# EAGLE design ThrottleControl (EAGLE 5.07)
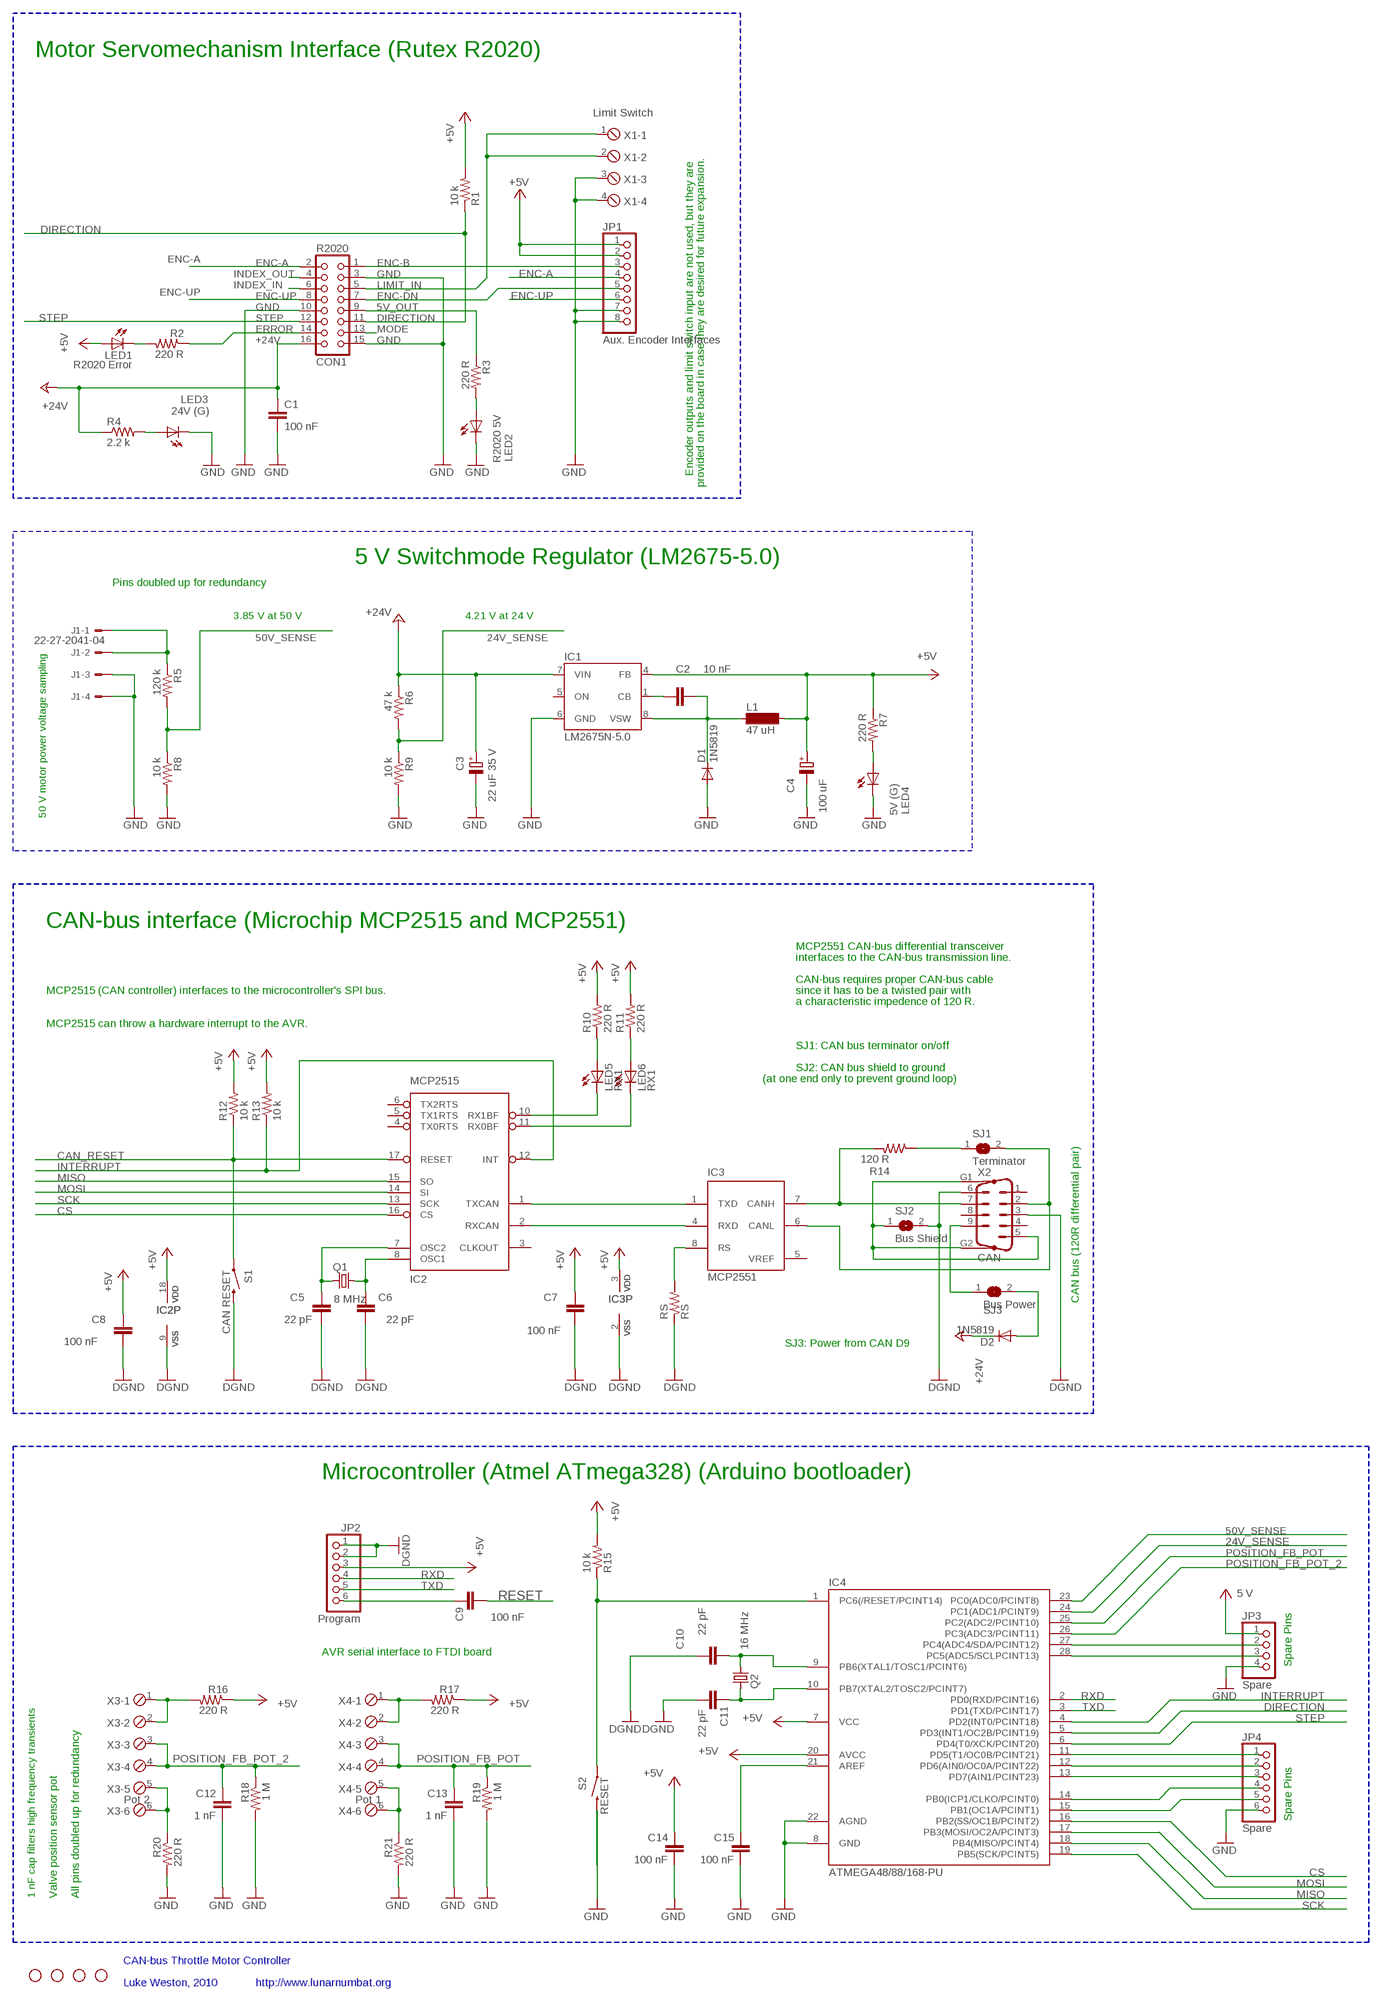
[diagram p0: schematic, sheet 1]

## Parts
C1  100 nF  C-EUC0805K  [C0805K]
C2  10 nF  C-EUC0805  [C0805]
C3  22 uF 35 V  CPOL-EUSMCD  [SMC_D]
C4  100 uF  CPOL-EUSMCD  [SMC_D]
C5  22 pF  C-EUC0805  [C0805]
C6  22 pF  C-EUC0805  [C0805]
C7  100 nF  C-EUC0805  [C0805]
C8  100 nF  C-EUC0805  [C0805]
C9  100 nF  C-EUC0805K  [C0805K]
C10  22 pF  C-EUC0805  [C0805]
C11  22 pF  C-EUC0805  [C0805]
C12  1 nF  C-EUC0805K  [C0805K]
C13  1 nF  C-EUC0805K  [C0805K]
C14  100 nF  C-EUC0805K  [C0805K]
C15  100 nF  C-EUC0805K  [C0805K]
CON1  R2020  CON16  [CON16]
D1  1N5819  DIODE-SOD123  [SOD123]
D2  1N5819  DIODE-SOD123  [SOD123]
IC1  LM2675N-5.0  LM2675M  [SO08]
IC2  MCP2515  MCP2510SO  [SO-18W]
IC3  MCP2551  MCP2551SN  [SO-08]
IC4  ATMEGA48/88/168-PU  [DIL28-3]
J1  22-27-2041-04  [6410-04]
JP1  Aux. Encoder Interfaces  PINHD-1X8  [1X08]
JP2  Program  PINHD-1X6  [1X06]
JP3  Spare  PINHD-1X4  [1X04]
JP4  Spare  PINHD-1X6  [1X06]
JP5  STAND-OFF  [STAND-OFF]
JP6  STAND-OFF  [STAND-OFF]
JP7  STAND-OFF  [STAND-OFF]
JP8  STAND-OFF  [STAND-OFF]
L1  47 uH  MS50  [MS50]
LED1  R2020 Error  LEDCHIP-LED0805  [CHIP-LED0805]
LED2  R2020 5V  LEDCHIP-LED0805  [CHIP-LED0805]
LED3  24V (G)  LEDCHIP-LED0805  [CHIP-LED0805]
LED4  5V (G)  LEDCHIP-LED0805  [CHIP-LED0805]
LED5  RX1  LEDCHIP-LED0805  [CHIP-LED0805]
LED6  RX1  LEDCHIP-LED0805  [CHIP-LED0805]
Q1  8 MHz  CRYSTALHC49UP  [HC49UP]
Q2  16 MHz  CRYSTALHC49UP  [HC49UP]
R1  10 k  R-US_M0805  [M0805]
R2  220 R  R-US_M0805  [M0805]
R3  220 R  R-US_M0805  [M0805]
R4  2.2 k  R-US_M0805  [M0805]
R5  120 k  R-US_M0805  [M0805]
R6  47 k  R-US_M0805  [M0805]
R7  220 R  R-US_M0805  [M0805]
R8  10 k  R-US_M0805  [M0805]
R9  10 k  R-US_M0805  [M0805]
R10  220 R  R-US_M0805  [M0805]
R11  220 R  R-US_M0805  [M0805]
R12  10 k  R-US_M0805  [M0805]
R13  10 k  R-US_M0805  [M0805]
R14  120 R  R-US_M0805  [M0805]
R15  10 k  R-US_M0805  [M0805]
R16  220 R  R-US_M0805  [M0805]
R17  220 R  R-US_M0805  [M0805]
R18  1 M  R-US_M0805  [M0805]
R19  1 M  R-US_M0805  [M0805]
R20  220 R  R-US_M0805  [M0805]
R21  220 R  R-US_M0805  [M0805]
RS  RS  R-US_M0805  [M0805]
S1  CAN RESET  SWITCH-MOMENTARY-2SMD  [TACTILE_SWITCH_SMD]
S2  RESET  SWITCH-MOMENTARY-2SMD  [TACTILE_SWITCH_SMD]
SJ1  Terminator  SJ  [SJ]
SJ2  Bus Shield  SJ  [SJ]
SJ3  Bus Power  SJ  [SJ]
X1  Limit Switch  MPT4  [4POL254]
X2  CAN  M09HP  [M09HP]
X3  Pot 2  MPT6  [6POL254]
X4  Pot 1  MPT6  [6POL254]

## Nets
5V_OUT: CON1.9 R3.1
24V_SENSE: IC4.24(PC1(ADC1/PCINT9)) R6.2 R9.1
50V_SENSE: IC4.23(PC0(ADC0/PCINT8)) R5.2 R8.1
+5V: C4.+ C7.2 C8.2 C14.1 IC1.4(FB) IC2.18(VDD) IC3.3(VDD) IC4.7(VCC) IC4.20(AVCC) JP1.1 JP1.2 JP2.3 JP3.1 L1.2 LED1.A R1.2 R7.1 R10.2 R11.2 R12.2 R13.2 R15.2 R16.1 R17.1 ; supply symbol labelled 5 V
+24V: C1.1 C3.+ CON1.16 D2.C IC1.7(VIN) R4.1 R6.1
CAN_RESET: IC2.17(RESET) R12.1 S1.1
CS: IC2.16(CS) IC4.16(PB2(SS/OC1B/PCINT2))
DIRECTION: CON1.11 IC4.5(PD3(INT1/OC2B/PCINT19)) R1.1
ENC-A: CON1.2 JP1.4
ENC-B: CON1.1 JP1.3
ENC-DN: CON1.7 JP1.5
ENC-UP: CON1.8 JP1.6
ERROR: CON1.14 R2.1
GND: C1.2 C3.- C4.- C5.1 C6.1 C7.1 C8.1 C10.1 C11.1 C12.2 C13.2 C14.2 C15.2 CON1.3 CON1.10 CON1.15 D1.A IC1.6(GND) IC2.9(VSS) IC3.2(VSS) IC4.8(GND) IC4.22(AGND) J1.3 J1.4 JP1.7 JP1.8 JP2.1 JP2.2 JP3.4 JP4.6 LED2.C LED3.C LED4.C R8.2 R9.2 R18.2 R19.2 R20.2 R21.2 RS.1 S1.3 S2.3 SJ2.2 X1.3 X1.4 X2.3 X2.6 ; supply symbol labelled DGND
INDEX_IN: CON1.6
INDEX_OUT: CON1.4
INTERRUPT: IC2.12(INT) IC4.4(PD2(INT0/PCINT18)) R13.1
LIMIT_IN: CON1.5 X1.1 X1.2
MISO: IC2.15(SO) IC4.18(PB4(MISO/PCINT4))
MODE: CON1.13
MOSI: IC2.14(SI) IC4.17(PB3(MOSI/OC2A/PCINT3))
N$1: D2.A SJ3.2
N$2: LED6.A R11.1
N$3: C15.1 IC4.21(AREF)
N$4: LED3.A R4.2
N$5: LED1.C R2.2
N$7: IC4.27(PC4(ADC4/SDA/PCINT12)) JP3.2
N$8: LED4.A R7.2
N$9: IC4.28(PC5(ADC5/SCLPCINT13)) JP3.3
N$10: R17.2 X4.1 X4.2
N$11: R21.1 X4.5 X4.6
N$13: LED2.A R3.2
N$14: LED5.A R10.1
N$15: IC3.8(RS) RS.2
N$16: IC3.7(CANH) R14.2 X2.7
N$17: IC3.6(CANL) SJ1.2 X2.2
N$18: J1.1 J1.2 R5.1
N$19: IC4.14(PB0(ICP1/CLKO/PCINT0)) JP4.4
N$20: IC4.15(PB1(OC1A/PCINT1)) JP4.5
N$21: IC4.12(PD6(AIN0/OC0A/PCINT22)) JP4.2
N$22: IC4.13(PD7(AIN1/PCINT23)) JP4.3
N$23: R16.2 X3.1 X3.2
N$24: C2.1 D1.C IC1.8(VSW) L1.1
N$25: IC4.11(PD5(T1/OC0B/PCINT21)) JP4.1
N$26: C10.2 IC4.9(PB6(XTAL1/TOSC1/PCINT6)) Q2.1
N$27: C11.2 IC4.10(PB7(XTAL2/TOSC2/PCINT7)) Q2.2
N$28: R14.1 SJ1.1
N$29: C9.1 JP2.6
N$30: SJ2.1 X2.5 X2.G1 X2.G2
N$31: R20.1 X3.5 X3.6
N$32: C2.2 IC1.1(CB)
N$33: SJ3.1 X2.9
N$39: IC2.1(TXCAN) IC3.1(TXD)
N$53: IC2.2(RXCAN) IC3.4(RXD)
N$54: C6.2 IC2.8(OSC1) Q1.1
N$56: C5.2 IC2.7(OSC2) Q1.2
N$65: IC2.11(RX0BF) LED6.C
N$72: IC2.10(RX1BF) LED5.C
POSITION_FB_POT: C13.1 IC4.25(PC2(ADC2/PCINT10)) R19.1 X4.3 X4.4
POSITION_FB_POT_2: C12.1 IC4.26(PC3(ADC3/PCINT11)) R18.1 X3.3 X3.4
RESET: C9.2 IC4.1(PC6(/RESET/PCINT14)) R15.1 S2.1
RXD: IC4.2(PD0(RXD/PCINT16)) JP2.4
SCK: IC2.13(SCK) IC4.19(PB5(SCK/PCINT5))
STEP: CON1.12 IC4.6(PD4(T0/XCK/PCINT20))
TXD: IC4.3(PD1(TXD/PCINT17)) JP2.5
Unconnected: IC1.5(ON) IC2.3(CLKOUT) IC2.4(TX0RTS) IC2.5(TX1RTS) IC2.6(TX2RTS) X2.1 X2.4 X2.8

## Buses
B$1
B$2
B$3
B$4

## Notes on the sheet
- Motor Servomechanism Interface (Rutex R2020)
- Encoder outputs and limit switch input are not used, but they are
- provided on the board in case they are desired for future expansion.
- 5 V Switchmode Regulator (LM2675-5.0)
- Pins doubled up for redundancy
- 3.85 V at 50 V | 4.21 V at 24 V
- 50 V motor power voltage sampling
- CAN-bus interface (Microchip MCP2515 and MCP2551)
- MCP2551 CAN-bus differential transceiver
- interfaces to the CAN-bus transmission line.
- CAN-bus requires proper CAN-bus cable
- MCP2515 (CAN controller) interfaces to the microcontroller's SPI bus. | since it has to be a twisted pair with
- a characteristic impedence of 120 R.
- MCP2515 can throw a hardware interrupt to the AVR.
- SJ1: CAN bus terminator on/off
- SJ2: CAN bus shield to ground
- (at one end only to prevent ground loop)
- CAN bus (120R differential pair)
- SJ3: Power from CAN D9
- Microcontroller (Atmel ATmega328) (Arduino bootloader)
- AVR serial interface to FTDI board
- Spare Pins
- Spare Pins
- 1 nF cap filters high frequency transients | Valve position sensor pot | All pins doubled up for redundancy
- CAN-bus Throttle Motor Controller
- Luke Weston, 2010 | http://www.lunarnumbat.org

## Power pins joined to a net without a drawn wire
VREF: IC3.5(VREF)

## Library data of the parts
C1 C9 C12-C15 = resistor:C-EU: CAPACITOR, European symbol
C2 C5-C8 C10 C11 = rcl:C-EU: CAPACITOR, European symbol
C3 C4 = resistor:CPOL-EU: POLARIZED CAPACITOR, European symbol
CON1 = con-harting:CON16: CONNECTOR
D1 D2 = diode:DIODE-: DIODE
IC1 = v-reg-3:LM2675: National Semiconductor <http://www.national.com> 1.0A "Simple Switcher"(c) 260kHz, Vout 1.2-37V, Vin 40V, 250mOhm DMOS switch, 50µA standby current
IC2 = microchip_can:MCP2510
IC3 = microchip_can:MCP2551: High Speed CAN tranceiver
IC4 = atmega8:ATMEGA48/88/168-PU
J1 = con-molex:22-?-04: CONNECTOR wire to board 2.54 mm (.1 inch) pitch header
JP1 = pinhead:PINHD-1X8: PIN HEADER
JP2 JP4 = pinhead:PINHD-1X6: PIN HEADER
JP3 = pinhead:PINHD-1X4: PIN HEADER
JP5-JP8 = SparkFun:STAND-OFF: Stand Off This is the mechanical footprint for a #4 phillips button head screw. Use the keepout ring to avoid running the screw head into surrounding components. SKU : PRT-00447
L1 = inductor-neosid:MS50: INDUCTOR SMD power inductor
LED1-LED6 = led:LED: LED OSRAM: - CHIPLED LG R971, LG N971, LY N971, LG Q971, LY Q971, LO R971, LY R971 LH N974, LH R974 LS Q976, LO Q976, LY Q976 LO Q996 - Hyper CHIPLED LW Q18S LB Q993, LB Q99A, LB R99A - SideLED LS A670, LO A670, LY A670, LG A670, LP A670 LB A673, LV A673, LT A673, LW A673 LH A674 LY A675 LS A676, LA A676, LO A676, LY A676, LW A676 LS A679, LY A679, LG A679 - Hyper Micro SIDELED® LS Y876, LA Y876, LO Y876, LY Y876 LT Y87S - SmartLED LW L88C, LW L88S LB L89C, LB L89S, LG L890 LS L89K, LO L89K, LY L89K LS L896, LA L896, LO L896, LY L896 - TOPLED LS T670, LO T670, LY T670, LG T670, LP T670 LSG T670, LSP T670, LSY T670, LOP T670, LYG T670 LG T671, LOG T671, LSG T671 LB T673, LV T673, LT T673, LW T673 LH T674 LS T676, LA T676, LO T676, LY T676, LB T676, LH T676, LSB T676, LW T676 LB T67C, LV T67C, LT T67C, LS T67K, LO T67K, LY T67K, LW E67C LS E67B, LA E67B, LO E67B, LY E67B, LB E67C, LV E67C, LT E67C LW T67C LS T679, LY T679, LG T679 LS T770, LO T770, LY T770, LG T770, LP T770 LB T773, LV T773, LT T773, LW T773 LH T774 LS E675, LA E675, LY E675, LS T675 LS T776, LA T776, LO T776, LY T776, LB T776 LHGB T686 LT T68C, LB T68C - Hyper Mini TOPLED® LB M676 - Mini TOPLED Santana® LG M470 LS M47K, LO M47K, LY M47K Source: http://www.osram.convergy.de LUXEON: - LUMILED® LXK2-PW12-R00, LXK2-PW12-S00, LXK2-PW14-U00, LXK2-PW14-V00 LXK2-PM12-R00, LXK2-PM12-S00, LXK2-PM14-U00 LXK2-PE12-Q00, LXK2-PE12-R00, LXK2-PE12-S00, LXK2-PE14-T00, LXK2-PE14-U00 LXK2-PB12-K00, LXK2-PB12-L00, LXK2-PB12-M00, LXK2-PB14-N00, LXK2-PB14-P00, LXK2-PB14-Q00 LXK2-PR12-L00, LXK2-PR12-M00, LXK2-PR14-Q00, LXK2-PR14-R00 LXK2-PD12-Q00, LXK2-PD12-R00, LXK2-PD12-S00 LXK2-PH12-R00, LXK2-PH12-S00 LXK2-PL12-P00, LXK2-PL12-Q00, LXK2-PL12-R00 Source: www.luxeon.com KINGBRIGHT: KA-3528ASYC Source: www.kingbright.com
Q1 Q2 = crystal:CRYSTAL: CRYSTAL
R1-R9 = resistor:R-US_: RESISTOR, American symbol
R10-R21 RS = rcl:R-US_: RESISTOR, American symbol
S1 S2 = SparkFun:SWITCH-MOMENTARY-2
SJ1-SJ3 = jumper:SJ: SMD solder JUMPER
X1 = con-phoenix-254:MPT4: PHOENIX CONNECTOR
X2 = con-subd:M09HP: SUB-D
X3 X4 = con-phoenix-254:MPT6: PHOENIX CONNECTOR

## Net classes
0 default: width 0.203 mm, drill 0.406 mm, clearance 0.203 mm

## Board
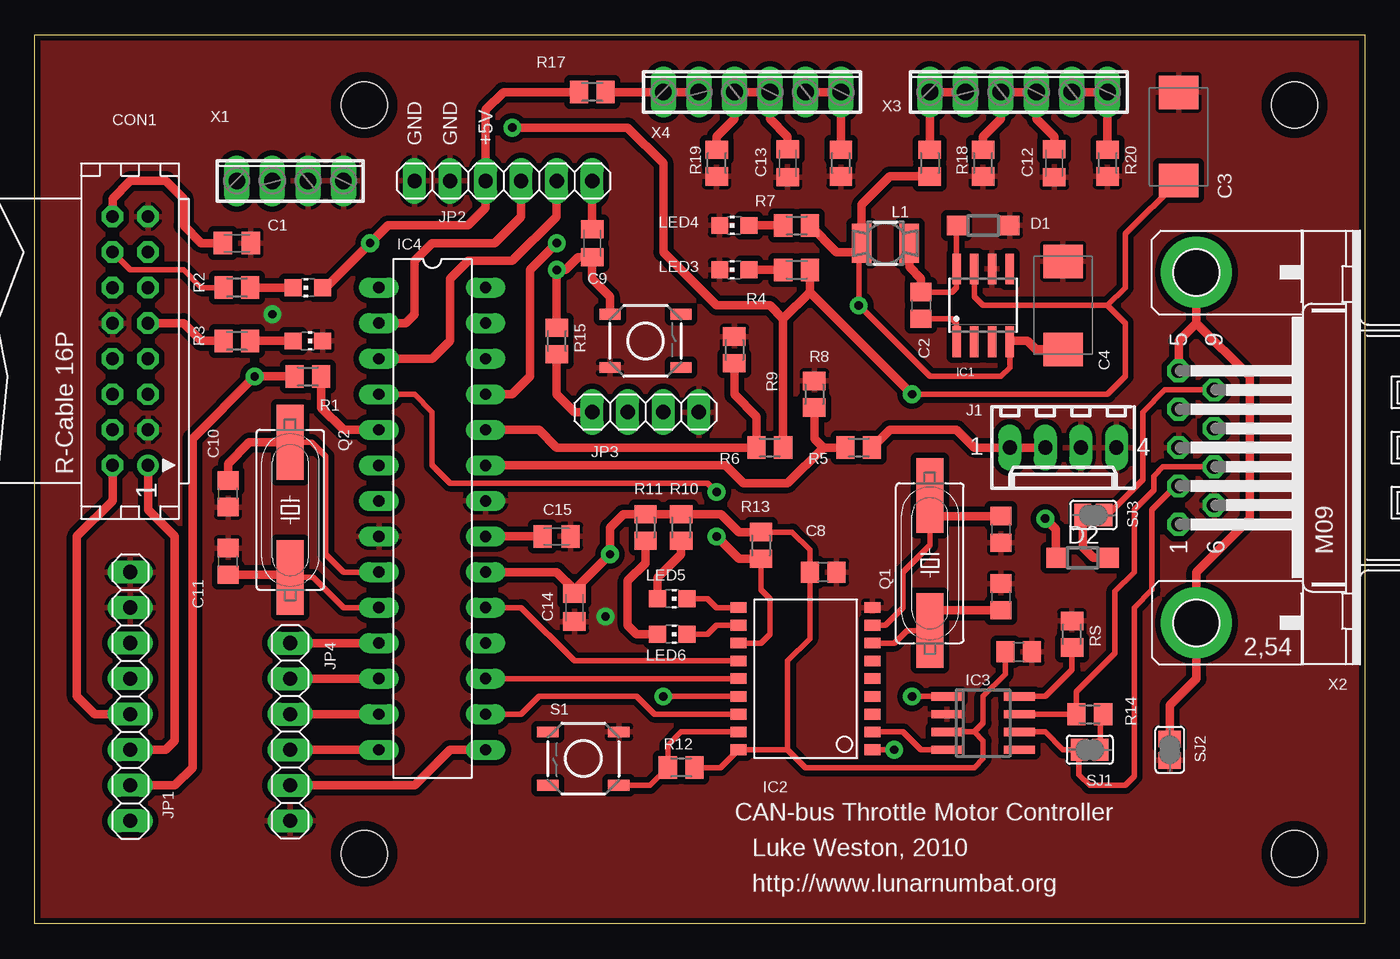
[diagram p1: board, top side]
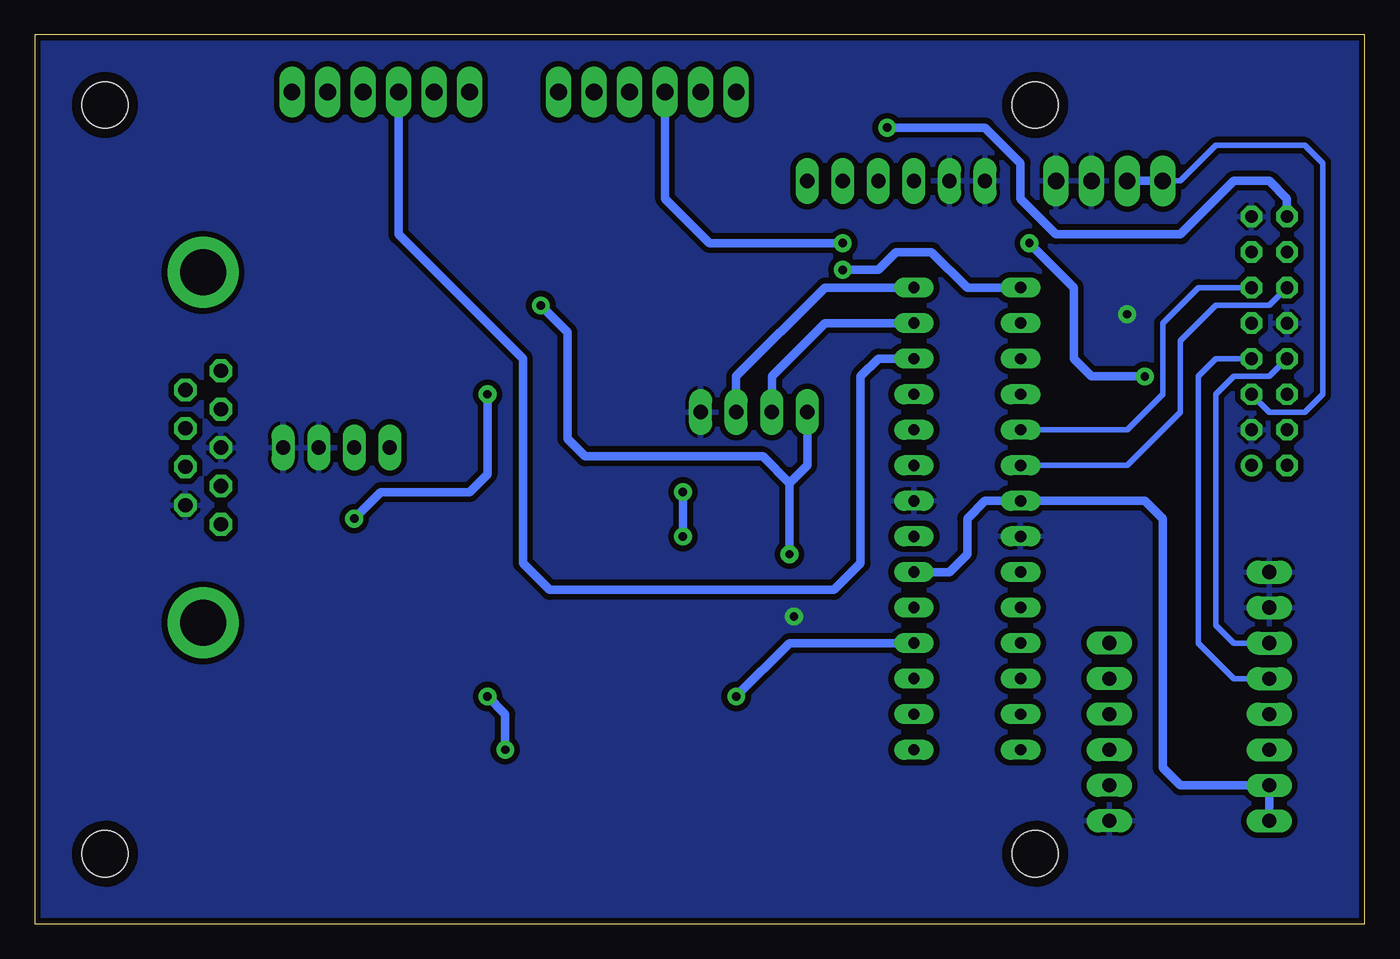
[diagram p2: board, bottom side, seen from below]

Size 95.03 x 63.5 mm. Coordinates in mm from the lower left corner, seen from the top.
Outline: 0,63.5 95.03,63.5 95.03,0 0,0 0,63.5
Copper layers (1*16): Top 0.035mm / dielectric 1.5mm / Bottom 0.035mm
Design rules "SparkFun": minimum track width 8mil, minimum drill 20mil, track to track 8mil, track to pad 8mil, pad to pad 8mil, via to via 8mil, smd to smd 8mil, copper to edge 10mil, drill to drill 8mil, minimum pad ring 12mil, minimum via ring 10mil, stop-mask expansion 4mil, vias tented up to drill 25mil, thermal gap 10mil

### Footprints (pad centres in the part's own frame; a part is rotated, then mirrored left to right if it is on the bottom)
C0805K = smd 1.3 x 1.6: 1 -1,0; 2 1,0
C0805 = smd 1.3 x 1.5: 1 -0.95,0; 2 0.95,0
SMC_D = smd 2.4 x 2.8: + -3.15,0; - 3.15,0
CON16 = drill 0.914 round: 1 -8.89,-1.27 | drill 0.914 octagon: 2 -8.89,1.27; 3 -6.35,-1.27; 4 -6.35,1.27; 5 -3.81,-1.27; 6 -3.81,1.27; 7 -1.27,-1.27; 8 -1.27,1.27; 9 1.27,-1.27; 10 1.27,1.27; 11 3.81,-1.27; 12 3.81,1.27; 13 6.35,-1.27; 14 6.35,1.27; 15 8.89,-1.27; 16 8.89,1.27
SOD123 = smd 1.4 x 1.4: A 1.9,0; C -1.9,0
SO08 = smd 0.6 x 2.2: 1 -1.905,-2.6; 2 -0.635,-2.6; 3 0.635,-2.6; 4 1.905,-2.6; 5 1.905,2.6; 6 0.635,2.6; 7 -0.635,2.6; 8 -1.905,2.6
SO-18W = smd 0.762 x 1.143: 1 -5.08,-4.788; 2 -3.81,-4.788; 3 -2.54,-4.788; 4 -1.27,-4.788; 5 0,-4.788; 6 1.27,-4.788; 7 2.54,-4.788; 8 3.81,-4.788; 9 5.08,-4.788; 10 5.08,4.788; 11 3.81,4.788; 12 2.54,4.788; 13 1.27,4.788; 14 0,4.788; 15 -1.27,4.788; 16 -2.54,4.788; 17 -3.81,4.788; 18 -5.08,4.788
SO-08 = smd 0.6 x 2.2: 1 -1.905,-2.6; 2 -0.635,-2.6; 3 0.635,-2.6; 4 1.905,-2.6; 5 1.905,2.6; 6 0.635,2.6; 7 -0.635,2.6; 8 -1.905,2.6
DIL28-3 = drill 0.813 long: 1 -16.51,-3.81; 2 -13.97,-3.81; 3 -11.43,-3.81; 4 -8.89,-3.81; 5 -6.35,-3.81; 6 -3.81,-3.81; 7 -1.27,-3.81; 8 1.27,-3.81; 9 3.81,-3.81; 10 6.35,-3.81; 11 8.89,-3.81; 12 11.43,-3.81; 13 13.97,-3.81; 14 16.51,-3.81; 15 16.51,3.81; 16 13.97,3.81; 17 11.43,3.81; 18 8.89,3.81; 19 6.35,3.81; 20 3.81,3.81; 21 1.27,3.81; 22 -1.27,3.81; 23 -3.81,3.81; 24 -6.35,3.81; 25 -8.89,3.81; 26 -11.43,3.81; 27 -13.97,3.81; 28 -16.51,3.81
6410-04 = drill 1.016 long: 1 3.81,0; 2 1.27,0; 3 -1.27,0; 4 -3.81,0
1X08 = drill 1.016 long: 1 -8.89,0; 2 -6.35,0; 3 -3.81,0; 4 -1.27,0; 5 1.27,0; 6 3.81,0; 7 6.35,0; 8 8.89,0
1X06 = drill 1.016 long: 1 -6.35,0; 2 -3.81,0; 3 -1.27,0; 4 1.27,0; 5 3.81,0; 6 6.35,0
1X04 = drill 1.016 long: 1 -3.81,0; 2 -1.27,0; 3 1.27,0; 4 3.81,0
STAND-OFF = hole 3.302: 0,0
MS50 = smd 2.8 x 1.4: 1 0,-1.7; 2 0,1.7
CHIP-LED0805 = smd 1.2 x 1.2: A 0,-1.05; C 0,1.05
HC49UP = smd 5.334 x 1.93: 1 -4.826,0; 2 4.826,0
M0805 = smd 1.3 x 1.6: 1 -0.95,0; 2 0.95,0
TACTILE_SWITCH_SMD = smd 1.524 x 0.762: 1 -2.54,1.905; 2 2.54,1.905; 3 -2.54,-1.905; 4 2.54,-1.905
SJ = smd 1.168 x 1.6: 1 -0.762,0; 2 0.762,0
4POL254 = drill 1.2 long: 1 -3.81,0; 2 -1.27,0; 3 1.27,0; 4 3.81,0
M09HP = drill 1.016 octagon: 1 -5.486,1.27; 2 -2.743,1.27; 3 0,1.27; 4 2.743,1.27; 5 5.486,1.27; 6 -4.115,-1.27; 7 -1.372,-1.27; 8 1.372,-1.27; 9 4.115,-1.27 | drill 3.302 pad 5.08 round: G1 -12.522,0; G2 12.522,0
6POL254 = drill 1.2 pad 1.778 long: 1 -6.35,0; 2 -3.81,0; 3 -1.27,0; 4 1.27,0; 5 3.81,0; 6 6.35,0

### Placement (x,y rotation side)
C1  14.43,48.62 0 top
C2  63.32,44.18 270 top
C3  81.74,56.25 90 top
C4  73.48,44.18 90 top
C5  69.04,23.35 270 top
C6  69.04,28.18 90 top
C7  70.31,19.42 180 top
C8  56.34,25.13 180 top
C9  39.83,48.62 270 top
C10  13.79,30.72 90 top
C11  13.79,25.89 270 top
C12  72.85,54.34 270 top
C13  53.8,54.34 270 top
C14  38.56,22.59 270 top
C15  37.29,27.67 0 top
CON1  6.81,41.64 90 top
D1  67.77,49.9 0 top
D2  74.88,26.15 0 top
IC1  67.77,44.18 0 top
IC2  55.07,17.51 90 top
IC3  67.77,14.34 270 top
IC4  28.4,28.94 270 top
J1  73.48,34.02 180 top
JP1  6.81,16.24 90 top
JP2  33.48,53.07 0 top
JP3  43.64,36.56 0 top
JP4  18.24,13.7 270 top
JP5  23.53,58.5 0 top
JP6  23.53,5 0 top
JP7  90.03,5 0 top
JP8  90.03,58.5 0 top
L1  60.78,48.62 90 top
LED1  19.51,45.45 90 top
LED2  19.51,41.64 270 top
LED3  49.99,46.72 90 top
LED4  49.99,49.9 90 top
LED5  45.55,23.23 270 top
LED6  45.55,20.69 270 top
Q1  63.96,25.77 270 top
Q2  18.24,29.58 270 top
R1  19.51,39.1 180 top
R2  14.43,45.45 0 top
R3  14.43,41.64 0 top
R4  54.43,46.72 180 top
R5  58.88,34.02 180 top
R6  52.53,34.02 180 top
R7  54.43,49.9 180 top
R8  55.7,37.83 90 top
R9  49.99,41.01 90 top
R10  46.18,28.31 90 top
R11  43.64,28.31 90 top
R12  46.18,11.16 0 top
R13  51.89,27.04 90 top
R14  75.39,14.97 180 top
R15  37.29,41.64 270 top
R16  63.96,54.34 90 top
R17  39.83,59.42 0 top
R18  67.77,54.34 270 top
R19  48.72,54.34 270 top
R20  76.66,54.34 270 top
R21  57.61,54.34 270 top
RS  74.12,20.69 270 top
S1  39.2,11.79 180 top
S2  43.64,41.64 0 top
SJ1  75.39,12.43 180 top
SJ2  81.11,12.43 270 top
SJ3  75.64,29.19 180 top
X1  18.24,53.07 0 top
X2  83.01,34.02 90 top
X3  70.31,59.42 0 top
X4  51.26,59.42 0 top

### Tracks (layer width: path | path; a pad name or v marks a point on that pad's centre or on a via)
5V_OUT
  Top 0.61: CON1.9 10.62,42.91 11.89,41.64 R3.1
24V_SENSE
  Top 0.61: IC4.24 36.02,35.29 37.29,34.02 R6.2 51.58,36.24 49.99,37.83 R9.1
50V_SENSE
  Top 0.61: 56.34,34.02 R5.2 | 56.34,34.02 53.8,31.48 50.62,31.48 49.35,32.75 IC4.23 | R8.1 55.7,34.66 56.34,34.02
+5V  (via drill 0.6 pad 1.27)
  Top 0.406: 53.8,12.43 55.07,11.16 67.14,11.16 67.77,11.79 67.77,13.06 67.14,13.7 | 53.8,12.43 IC2.18 49.01,11.16 R12.2 | R11.2 43.32,29.26 43.64,29.58 | 53.8,12.43 53.8,18.78 55.39,20.37 C8.2 55.39,26.72 54.12,27.99 R13.2 | 67.14,13.7 IC3.3 | 67.14,13.7 67.77,14.34 67.77,16.24 69.36,17.83 C7.2 | 42.05,29.26 | 20.78,45.45 LED1.A | 69.73,41.64 IC1.4 69.67,39.73 69.04,39.1 63.96,39.1 v58.88,44.18 58.88,47.99
  Top 0.61: R11.2 R10.2 49.04,29.26 50.31,27.99 R13.2 | 43.32,29.26 42.05,29.26 41.1,28.31 v41.1,26.4 38.56,23.86 | IC4.20 37.29,25.13 38.56,23.86 | 20.78,45.45 v23.96,48.62 25.23,49.9 30.94,49.9 32.21,51.16 JP2.3 32.21,58.15 33.48,59.42 R17.1 | 38.56,23.86 C14.1 | R1.2 v15.7,39.1 11.26,34.66 11.26,11.16 9.98,9.89 JP1.2 | C4.+ 71.55,41.03 70.94,41.64 69.73,41.64 | R16.1 61.1,53.39 59.09,51.37 L1.2 59.09,47.99 58.88,47.99 57.29,47.99 R7.1 | JP3.1 38.56,36.56 37.29,37.83 R15.2
  Bottom 0.61: IC4.20 29.67,25.13 28.4,26.4 28.4,28.94 27.13,30.21 IC4.7 15.7,30.21 14.43,28.94 14.43,11.16 13.16,9.89 JP1.2 JP1.1 | 41.1,31.48 39.83,32.75 JP3.1 | 41.1,31.48 43,33.39 55.7,33.39 56.98,34.66 56.98,42.27 v58.88,44.18 | v41.1,26.4 41.1,31.48 | v15.7,39.1 19.51,39.1 20.78,40.37 20.78,45.45 v23.96,48.62
+24V  (via drill 0.6 pad 1.27)
  Top 0.406: C1.1 13.43,48.99 | IC1.7 67.14,44.82 67.77,44.18 76.66,44.18 | v62.69,37.83 76.66,37.83 77.93,39.1 77.93,42.91 76.66,44.18 | 76.66,44.18 77.93,45.45 77.93,49.29 C3.+
  Top 0.61: C1.1 11.89,48.62 10.62,49.9 10.62,51.8 9.35,53.07 6.81,53.07 5.54,51.8 CON1.16 | v34.11,56.88 42.37,56.88 44.91,54.34 44.91,47.99 48.72,44.18 52.52,44.18 53.48,43.23 | 55.38,45.14 55.38,45.13 53.48,43.23 | 53.48,43.23 R6.1 | 55.38,45.14 R4.1 | 55.38,45.14 v62.69,37.83 | D2.C 72.98,28.17 v72.22,28.94
  Bottom 0.61: v72.22,28.94 70.31,30.85 63.96,30.85 62.69,32.12 v62.69,37.83 | CON1.16 5.54,51.8 6.81,53.07 9.35,53.07 13.16,49.26 22.05,49.26 24.59,51.8 24.59,54.34 27.13,56.88 v34.11,56.88
CAN_RESET
  Top 0.406: IC2.17 46.18,13.7 45.23,12.75 R12.1 43.96,9.89 S1.1
CS
  Top 0.406: IC4.16 34.75,14.97 36.02,16.24 43,16.24 44.27,14.97 IC2.16
DIRECTION
  Top 0.61: R1.1 20.46,36.88 22.05,35.29 IC4.5
  Bottom 0.406: CON1.11 11.89,45.45 14.43,42.91 14.43,37.83 16.97,35.29 IC4.5
ENC-A
  Top 0.61: JP1.4 4.27,14.97 3,16.24 3,27.67 5.54,30.21 CON1.2
ENC-B
  Top 0.61: JP1.3 9.35,12.43 9.98,13.06 9.98,27.67 8.08,29.58 CON1.1
ENC-DN
  Bottom 0.406: CON1.7 10.62,40.37 11.89,39.1 11.89,20.05 9.35,17.51 JP1.5
ENC-UP
  Bottom 0.406: CON1.8 6.81,39.1 9.35,39.1 10.62,37.83 10.62,21.32 9.35,20.05 JP1.6
ERROR
  Top 0.406: CON1.14 6.81,46.72 10.62,46.72 11.89,45.45 R2.1
GND  (via drill 0.6 pad 1.27)
  Top 0.406: IC4.8 23.32,27.67
  other vias: 16.97,43.55 40.78,21.96
  pour Bottom (isolate 0.406): -1.32,64.75 95.71,64.5 95.2,-1.29 -1.32,-1.29
  pour Top (isolate 0.406): -1.32,64.75 95.71,64.5 95.2,-1.29 -1.32,-1.29
INTERRUPT  (via drill 0.6 pad 1.27)
  Top 0.406: IC2.12 51.89,20.05 52.53,20.69 52.53,23.23 51.89,23.86 R13.1 | IC4.4 27.13,37.83 28.4,36.56 28.4,32.75 29.67,31.48 48.09,31.48 v48.72,30.85
  Top 0.61: R13.1 50.3,26.09 v48.72,27.67
  Bottom 0.61: v48.72,30.85 v48.72,27.67
LIMIT_IN
  Bottom 0.406: CON1.5 6.81,36.56 4.27,36.56 3,37.83 3,54.34 4.27,55.61 10.62,55.61 13.16,53.07 X1.1
  Bottom 0.61: X1.1 X1.2
MISO  (via drill 0.6 pad 1.27)
  Top 0.406: v44.91,16.24 IC2.15
  Bottom 0.61: IC4.18 41.1,20.05 v44.91,16.24
MOSI
  Top 0.406: IC4.17 IC2.14
N$1
  Top 0.61: SJ3.2 74.88,26.91 75.64,26.15 D2.A
N$2
  Top 0.61: LED6.A 43,20.69 42.37,21.32 42.37,24.5 43.64,25.77 R11.1
N$3
  Top 0.61: IC4.21 C15.1
N$4
  Top 0.61: LED3.A R4.2
N$5
  Top 0.61: R2.2 LED1.C
N$7
  Bottom 0.61: IC4.27 38.56,42.91 42.37,39.1 JP3.2
N$8
  Top 0.61: LED4.A R7.2
N$9
  Bottom 0.61: IC4.28 38.56,45.45 44.91,39.1 JP3.3
N$10
  Top 0.61: X4.2 X4.1 R17.2
N$11
  Top 0.61: R21.1 X4.6 X4.5
N$13
  Top 0.61: R3.2 LED2.A
N$14
  Top 0.61: LED5.A 44.49,24.72 46.18,26.4 R10.1
N$15
  Top 0.406: RS.2 74.12,18.15 72.22,16.24 IC3.8
N$16
  Top 0.406: IC3.7 R14.2 74.44,16.56 77.19,19.31 77.19,23.76 78.56,25.13 78.56,29.58 79.96,30.97 79.96,31.99 80.62,32.65 X2.7
N$17
  Top 0.406: IC3.6 72.22,13.7 73.48,12.43 SJ1.2 74.63,10.65 75.39,9.89 77.93,9.89 78.56,10.53 78.56,22.59 79.83,23.86 79.83,29.58 81.54,31.28 X2.2
N$18
  Top 0.61: J1.2 J1.1 67.14,34.02 65.86,35.29 61.1,35.29 R5.1
N$19
  Top 0.61: JP4.4 IC4.14
N$20
  Top 0.61: JP4.5 27.13,9.89 29.67,12.43 IC4.15
N$21
  Top 0.61: JP4.2 IC4.12
N$22
  Top 0.61: JP4.3 IC4.13
N$23
  Top 0.61: X3.2 X3.1 R16.2
N$24
  Top 0.406: C2.1 65.55,45.13 65.86,45.45 IC1.8 D1.C
  Top 0.61: C2.1 63.32,46.09 62.48,46.93 L1.1
N$25
  Top 0.61: JP4.1 IC4.11
N$26
  Top 0.406: Q2.1 19.76,34.4 20.78,33.39 20.78,26.4 22.05,25.13 IC4.9
  Top 0.61: 18.24,32.75 Q2.1 15.32,34.4 13.79,32.88 C10.2
N$27
  Top 0.406: IC4.10 22.05,22.59 19.89,24.75 Q2.2
  Top 0.61: C11.2 18.05,24.94 Q2.2
N$28
  Top 0.406: SJ1.1 76.15,14.78 R14.1
N$29
  Top 0.61: C9.1 JP2.6
N$30
  Top 0.61: SJ2.1 81.11,15.61 83.01,17.51 X2.G1 83.01,25.13 86.82,28.94 86.82,39.1 83.01,42.91 | X2.5 81.74,41.64 83.01,42.91 | 83.01,42.91 X2.G2
N$31
  Top 0.61: X3.5 X3.6 R20.1
N$32
  Top 0.406: C2.2 65.55,43.23 65.86,42.91 IC1.1
N$33
  Top 0.406: X2.9 80.77,38.14 79.2,36.56 79.2,31.73 76.66,29.19 SJ3.1
N$39  (via drill 0.6 pad 1.27)
  Top 0.406: IC2.1 v61.42,12.43 | v62.69,16.24 IC3.1
  Bottom 0.61: v61.42,12.43 61.42,14.97 v62.69,16.24
N$53
  Top 0.406: IC2.2 62.05,13.7 63.32,12.43 IC3.4
N$54
  Top 0.406: IC2.8 60.78,21.32 62.05,22.59 62.05,25.13 63.96,27.04 63.96,28.31 | 63.96,28.31 63.96,28.94 Q1.1 | 63.96,28.31 64.27,28.62
  Top 0.61: C6.2 64.15,29.13 63.96,28.94
N$56
  Top 0.406: IC2.7 61.42,20.05 62.31,20.94 63.32,20.94 | 63.32,20.94 Q1.2 | 63.64,22.91 63.32,22.59 63.32,20.94
  Top 0.61: C5.2 64.15,22.4 63.64,22.91
N$65
  Top 0.406: LED6.C 48.09,20.69 48.72,21.32 IC2.11
N$72
  Top 0.406: LED5.C 48.09,23.23 48.72,22.59 IC2.10
POSITION_FB_POT  (via drill 0.6 pad 1.27)
  Top 0.61: IC4.25 34.11,37.83 35.38,39.1 35.38,46.72 v37.29,48.62 | R19.1 48.72,56.25 49.99,57.52 X4.3 X4.4 52.53,57.52 53.8,56.25 C13.1
  Bottom 0.61: v37.29,48.62 46.81,48.62 49.99,51.8 X4.3
POSITION_FB_POT_2
  Top 0.61: R18.1 67.77,56.25 69.04,57.52 X3.3 X3.4 71.58,57.52 72.85,56.25 C12.1
  Bottom 0.61: IC4.26 34.75,40.37 36.02,39.1 36.02,25.77 37.92,23.86 58.24,23.86 60.15,25.77 60.15,40.37 69.04,49.26 X3.3
RESET  (via drill 0.6 pad 1.27)
  Top 0.61: R15.1 v37.29,46.72 37.92,46.72 38.83,47.62 C9.2 39.83,46.09 41.1,44.82 S2.1
  Bottom 0.61: v37.29,46.72 34.75,46.72 33.48,47.99 30.94,47.99 28.4,45.45 IC4.1
RXD
  Top 0.61: JP2.4 34.75,50.53 32.84,48.62 28.4,48.62 27.13,47.36 27.13,43.55 26.5,42.91 IC4.2
SCK
  Top 0.406: IC4.19 34.75,22.59 38.56,18.78 IC2.13
STEP
  Bottom 0.406: CON1.12 6.81,44.18 10.62,44.18 13.16,41.64 13.16,36.56 16.97,32.75 IC4.6
TXD
  Top 0.61: JP2.5 37.29,50.53 34.11,47.36 30.94,47.36 29.67,46.09 29.67,41.64 28.4,40.37 IC4.3

### Text on the board
tPlace: GND | GND | +5V | CAN-bus Throttle Motor Controller | Luke Weston, 2010 | http://www.lunarnumbat.org